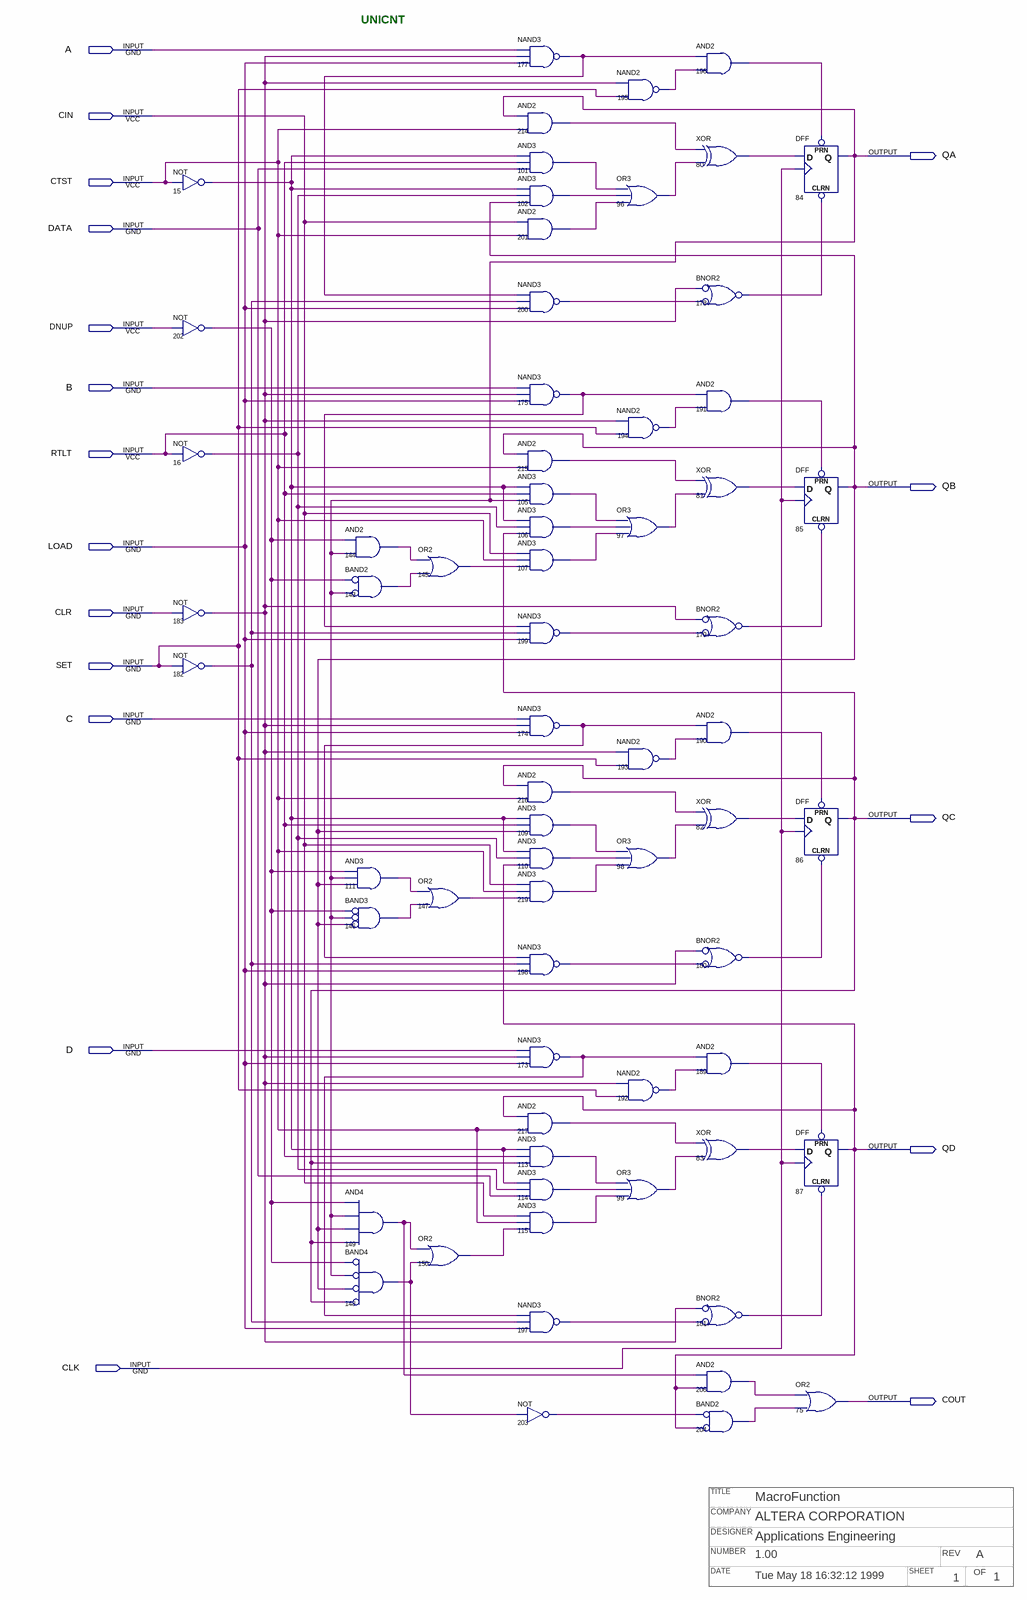
[diagram p0: schematic sheet]
// Quartus schematic unicnt.bdf as structural Verilog: 66 symbols, 18 pins
// Title block: TITLE: MacroFunction; COMPANY: ALTERA CORPORATION; DESIGNER: Applications Engineering; NUMBER: 1.00; REV: A; DATE: Tue May 18 16:32:12 1999; SHEET: 1; OF: 1
module unicnt (
  input  A,
  input  CIN,
  input  CTST,
  input  DATA,
  input  DNUP,
  input  B,
  input  RTLT,
  input  LOAD,
  input  CLR,
  input  SET,
  input  C,
  input  D,
  input  CLK,
  output QA,
  output QB,
  output QC,
  output QD,
  output COUT
);

  wire n15_out, n16_out, n80_out, n81_out, n82_out, n83_out, n96_out, n97_out, n98_out, n99_out, n101_out,
       n102_out, n105_out, n106_out, n107_out, n109_out, n110_out, n111_out, n113_out, n114_out, n115_out,
       n143_out, n144_out, n145_out, n146_out, n147_out, n148_out, n149_out, n150_out, n173_out, n174_out,
       n175_out, n177_out, n178_out, n179_out, n180_out, n181_out, n182_out, n183_out, n189_out, n190_out,
       n191_out, n192_out, n193_out, n194_out, n195_out, n196_out, n197_out, n198_out, n199_out, n200_out,
       n201_out, n202_out, n203_out, n204_out, n206_out, n214_out, n215_out, n216_out, n217_out, n219_out;

  not u_15 (n15_out, CTST);
  not u_202 (n202_out, DNUP);
  not u_16 (n16_out, RTLT);
  not u_183 (n183_out, CLR);
  not u_182 (n182_out, SET);
  and u_144 (n144_out, n202_out, QA);
  and u_143 (n143_out, ~n202_out, ~QA);  // BAND2
  and u_111 (n111_out, n202_out, QA, QB);
  and u_146 (n146_out, ~n202_out, ~QA, ~QB);  // BAND3
  and u_149 (n149_out, n202_out, QA, QB, QC);
  and u_148 (n148_out, ~n202_out, ~QA, ~QB, ~QC);  // BAND4
  or u_145 (n145_out, n144_out, n143_out);
  or u_147 (n147_out, n111_out, n146_out);
  or u_150 (n150_out, n149_out, n148_out);
  nand u_177 (n177_out, A, n183_out, LOAD);
  and u_214 (n214_out, QA, CTST);
  and u_101 (n101_out, n15_out, RTLT, DATA);
  and u_102 (n102_out, n15_out, n16_out, QB);
  and u_201 (n201_out, CIN, CTST);
  nand u_200 (n200_out, n177_out, n182_out, LOAD);
  nand u_175 (n175_out, B, n183_out, LOAD);
  and u_215 (n215_out, QB, CTST);
  and u_105 (n105_out, n15_out, RTLT, QA);
  and u_106 (n106_out, n15_out, n16_out, QC);
  and u_107 (n107_out, CIN, CTST, n145_out);
  nand u_199 (n199_out, n175_out, n182_out, LOAD);
  nand u_174 (n174_out, C, n183_out, LOAD);
  and u_216 (n216_out, QC, CTST);
  and u_109 (n109_out, n15_out, RTLT, QB);
  and u_110 (n110_out, n15_out, n16_out, QD);
  and u_219 (n219_out, CIN, CTST, n147_out);
  nand u_198 (n198_out, n174_out, n182_out, LOAD);
  nand u_173 (n173_out, D, n183_out, LOAD);
  and u_217 (n217_out, QD, CTST);
  and u_113 (n113_out, n15_out, RTLT, QC);
  and u_114 (n114_out, n15_out, n16_out, DATA);
  and u_115 (n115_out, CIN, CTST, n150_out);
  nand u_197 (n197_out, n173_out, n182_out, LOAD);
  not u_203 (n203_out, n148_out);
  nand u_195 (n195_out, n183_out, SET);
  or u_96 (n96_out, n101_out, n102_out, n201_out);
  nand u_194 (n194_out, n183_out, SET);
  or u_97 (n97_out, n105_out, n106_out, n107_out);
  nand u_193 (n193_out, n183_out, SET);
  or u_98 (n98_out, n109_out, n110_out, n219_out);
  nand u_192 (n192_out, n183_out, SET);
  or u_99 (n99_out, n113_out, n114_out, n115_out);
  and u_196 (n196_out, n177_out, n195_out);
  xor u_80 (n80_out, n214_out, n96_out);
  nor u_178 (n178_out, ~n183_out, ~n200_out);  // BNOR2
  and u_191 (n191_out, n175_out, n194_out);
  xor u_81 (n81_out, n215_out, n97_out);
  nor u_179 (n179_out, ~n183_out, ~n199_out);  // BNOR2
  and u_190 (n190_out, n174_out, n193_out);
  xor u_82 (n82_out, n216_out, n98_out);
  nor u_180 (n180_out, ~n183_out, ~n198_out);  // BNOR2
  and u_189 (n189_out, n173_out, n192_out);
  xor u_83 (n83_out, n217_out, n99_out);
  nor u_181 (n181_out, ~n183_out, ~n197_out);  // BNOR2
  and u_206 (n206_out, n149_out, QD);
  and u_204 (n204_out, ~n203_out, ~QD);  // BAND2
  DFF u_84 (.CLRN(n178_out), .CLK(CLK), .D(n80_out), .PRN(n196_out), .Q(QA));
  DFF u_85 (.CLRN(n179_out), .CLK(CLK), .D(n81_out), .PRN(n191_out), .Q(QB));
  DFF u_86 (.CLRN(n180_out), .CLK(CLK), .D(n82_out), .PRN(n190_out), .Q(QC));
  DFF u_87 (.CLRN(n181_out), .CLK(CLK), .D(n83_out), .PRN(n189_out), .Q(QD));
  or u_75 (COUT, n206_out, n204_out);

  // Notes on the sheet:
  //   UNICNT
endmodule
